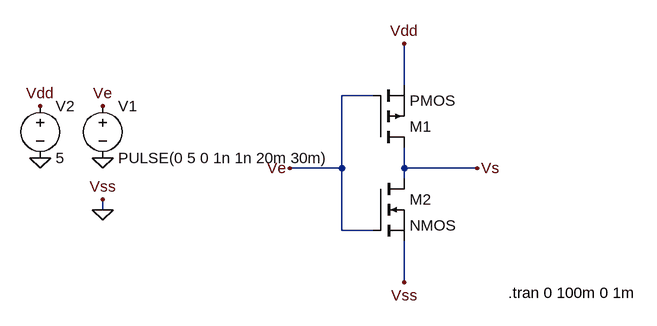
[diagram p0: schematic NON.asc]
NON.asc, the LTspice schematic file:
Version 4
SHEET 1 880 680
WIRE -336 -288 -336 -352
WIRE -384 -272 -432 -272
WIRE -432 -160 -432 -272
WIRE -432 -160 -512 -160
WIRE -336 -160 -336 -192
WIRE -224 -160 -336 -160
WIRE -336 -144 -336 -160
WIRE -800 -96 -800 -112
WIRE -432 -64 -432 -160
WIRE -384 -64 -432 -64
WIRE -336 16 -336 -48
FLAG -512 -160 Ve
FLAG -336 16 Vss
FLAG -336 -352 Vdd
FLAG -224 -160 Vs
FLAG -800 -176 0
FLAG -800 -256 Ve
FLAG -800 -96 0
FLAG -800 -112 Vss
FLAG -896 -176 0
FLAG -896 -256 Vdd
SYMBOL nmos -384 -144 R0
SYMATTR InstName M2
SYMBOL pmos -384 -192 M180
SYMATTR InstName M1
SYMBOL voltage -800 -272 R0
WINDOW 123 0 0 Left 0
WINDOW 39 0 0 Left 0
SYMATTR InstName V1
SYMATTR Value PULSE(0 5 0 1n 1n 20m 30m)
SYMBOL voltage -896 -272 R0
SYMATTR InstName V2
SYMATTR Value 5
TEXT -176 32 Left 2 !.tran 0 100m 0 1m

The netlist it stands for:
* NON.asc
M2 Vs Ve 0 0 NMOS
M1 Vs Ve Vdd Vdd PMOS
V1 Ve 0 PULSE(0 5 0 1n 1n 20m 30m)
V2 Vdd 0 5
.model NMOS NMOS
.model PMOS PMOS
.lib standard.mos
.tran 0 100m 0 1m
.backanno
.end